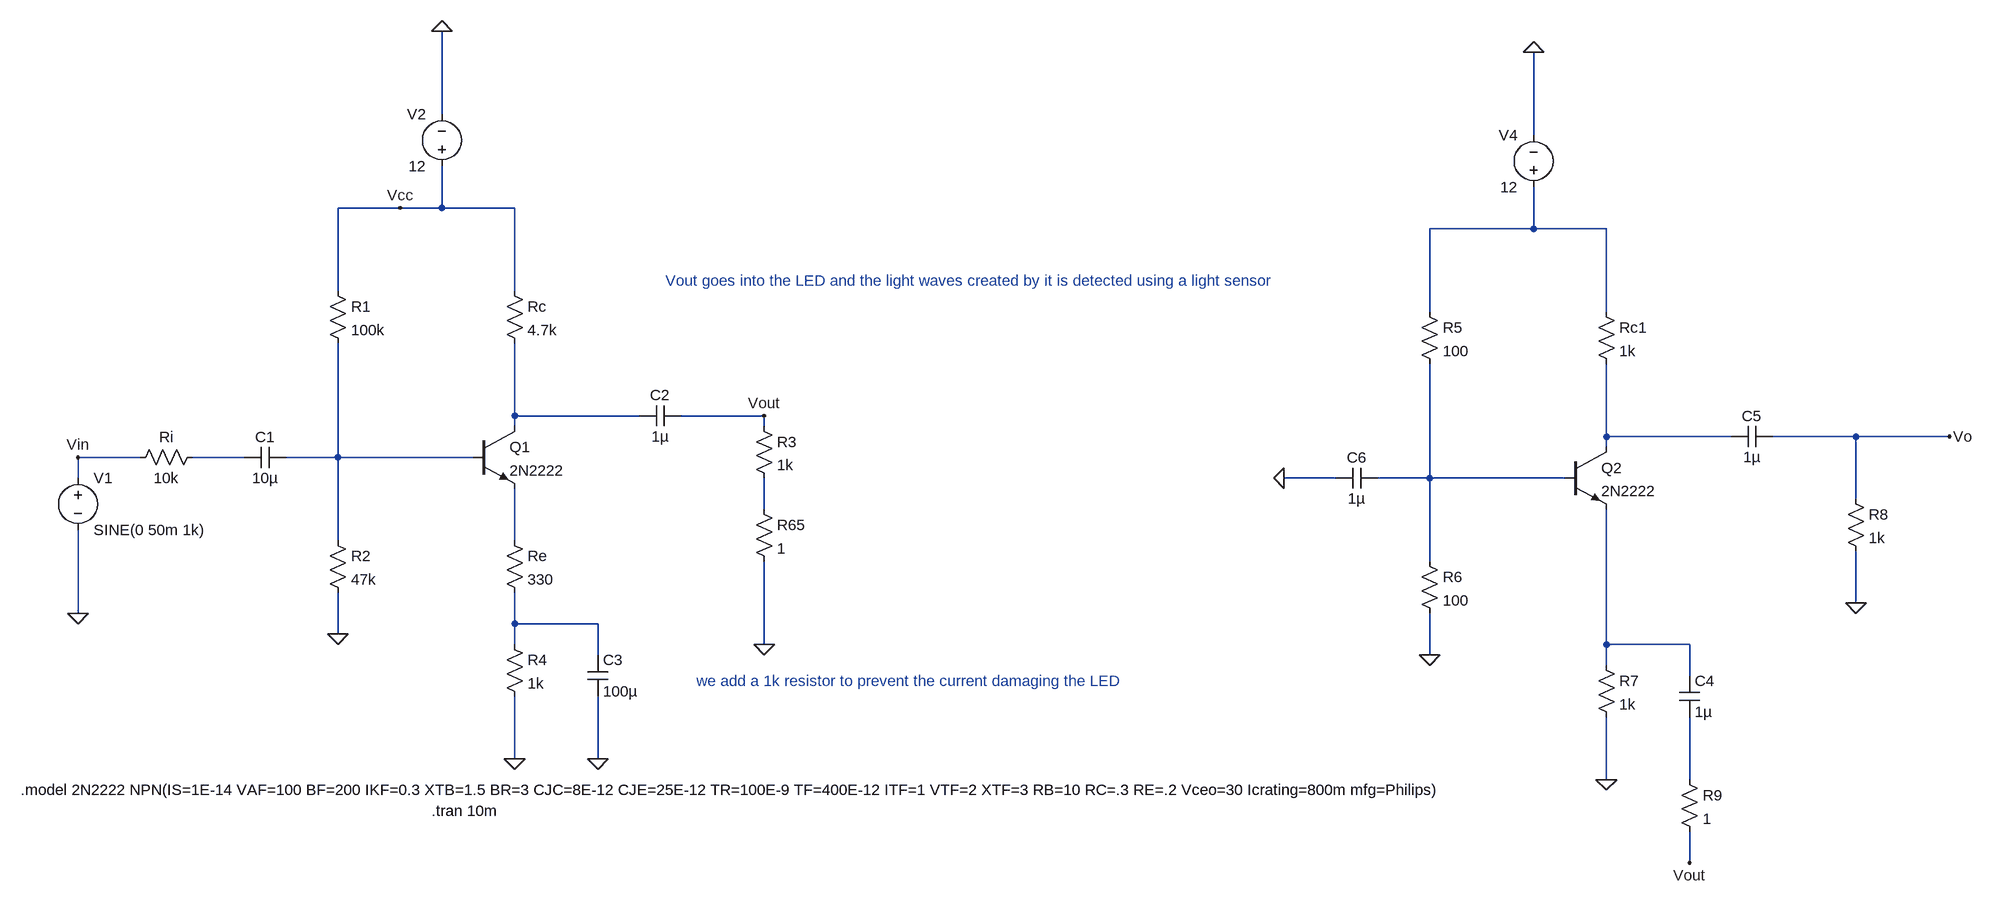
[diagram p0: schematic projects_deneme.asc]
projects_deneme.asc, the LTspice schematic file:
Version 4
SHEET 1 3096 1028
WIRE 304 -224 304 -352
WIRE 1984 -192 1984 -320
WIRE 240 -80 144 -80
WIRE 304 -80 304 -144
WIRE 304 -80 240 -80
WIRE 416 -80 304 -80
WIRE 1984 -48 1984 -112
WIRE 1984 -48 1824 -48
WIRE 2096 -48 1984 -48
WIRE 144 48 144 -80
WIRE 416 48 416 -80
WIRE 1824 80 1824 -48
WIRE 2096 80 2096 -48
WIRE 416 240 416 128
WIRE 608 240 416 240
WIRE 800 240 672 240
WIRE 416 256 416 240
WIRE 800 256 800 240
WIRE 2096 272 2096 160
WIRE 2288 272 2096 272
WIRE 2480 272 2352 272
WIRE 2624 272 2480 272
WIRE 2096 288 2096 272
WIRE -160 304 -256 304
WIRE 0 304 -80 304
WIRE 144 304 144 128
WIRE 144 304 64 304
WIRE 352 304 144 304
WIRE -256 336 -256 304
WIRE 1680 336 1600 336
WIRE 1824 336 1824 160
WIRE 1824 336 1744 336
WIRE 2032 336 1824 336
WIRE 2480 368 2480 272
WIRE 800 384 800 336
WIRE 144 432 144 304
WIRE 416 432 416 352
WIRE 1824 464 1824 336
WIRE 2480 528 2480 448
WIRE -256 544 -256 416
WIRE 416 560 416 512
WIRE 544 560 416 560
WIRE 144 576 144 512
WIRE 416 592 416 560
WIRE 800 592 800 464
WIRE 2096 592 2096 384
WIRE 2224 592 2096 592
WIRE 544 608 544 560
WIRE 1824 608 1824 544
WIRE 2096 624 2096 592
WIRE 2224 640 2224 592
WIRE 416 768 416 672
WIRE 544 768 544 672
WIRE 2096 800 2096 704
WIRE 2224 800 2224 704
WIRE 2224 928 2224 880
FLAG 304 -352 0
FLAG -256 544 0
FLAG 144 576 0
FLAG 416 768 0
FLAG 544 768 0
FLAG 800 592 0
FLAG -256 304 Vin
FLAG 240 -80 Vcc
FLAG 1984 -320 0
FLAG 1824 608 0
FLAG 2096 800 0
FLAG 2624 272 Vo
FLAG 1600 336 0
FLAG 2224 928 Vout
FLAG 2480 528 0
FLAG 800 240 Vout
SYMBOL res 128 32 R0
SYMATTR InstName R1
SYMATTR Value 100k
SYMBOL res 400 32 R0
SYMATTR InstName Rc
SYMATTR Value 4.7k
SYMBOL res 128 416 R0
SYMATTR InstName R2
SYMATTR Value 47k
SYMBOL res 400 416 R0
SYMATTR InstName Re
SYMATTR Value 330
SYMBOL res 400 576 R0
SYMATTR InstName R4
SYMATTR Value 1k
SYMBOL res 784 368 R0
SYMATTR InstName R65
SYMATTR Value 1
SYMBOL cap 528 608 R0
SYMATTR InstName C3
SYMATTR Value 100µ
SYMBOL cap 672 224 R90
WINDOW 0 0 32 VBottom 2
WINDOW 3 32 32 VTop 2
SYMATTR InstName C2
SYMATTR Value 1µ
SYMBOL res -64 288 R90
WINDOW 0 0 56 VBottom 2
WINDOW 3 32 56 VTop 2
SYMATTR InstName Ri
SYMATTR Value 10k
SYMBOL cap 64 288 R90
WINDOW 0 0 32 VBottom 2
WINDOW 3 32 32 VTop 2
SYMATTR InstName C1
SYMATTR Value 10µ
SYMBOL voltage -256 320 R0
WINDOW 123 0 0 Left 0
WINDOW 39 0 0 Left 0
SYMATTR InstName V1
SYMATTR Value SINE(0 50m 1k)
SYMBOL voltage 304 -128 R180
WINDOW 0 24 96 Left 2
WINDOW 3 24 16 Left 2
WINDOW 123 0 0 Left 0
WINDOW 39 0 0 Left 0
SYMATTR InstName V2
SYMATTR Value 12
SYMBOL npn 352 256 R0
SYMATTR InstName Q1
SYMATTR Value 2N2222
SYMBOL res 784 240 R0
SYMATTR InstName R3
SYMATTR Value 1k
SYMBOL res 1808 64 R0
SYMATTR InstName R5
SYMATTR Value 100
SYMBOL res 2080 64 R0
SYMATTR InstName Rc1
SYMATTR Value 1k
SYMBOL res 1808 448 R0
SYMATTR InstName R6
SYMATTR Value 100
SYMBOL res 2080 608 R0
SYMATTR InstName R7
SYMATTR Value 1k
SYMBOL cap 2208 640 R0
SYMATTR InstName C4
SYMATTR Value 1µ
SYMBOL cap 2352 256 R90
WINDOW 0 0 32 VBottom 2
WINDOW 3 32 32 VTop 2
SYMATTR InstName C5
SYMATTR Value 1µ
SYMBOL cap 1744 320 R90
WINDOW 0 0 32 VBottom 2
WINDOW 3 32 32 VTop 2
SYMATTR InstName C6
SYMATTR Value 1µ
SYMBOL voltage 1984 -96 R180
WINDOW 0 24 96 Left 2
WINDOW 3 24 16 Left 2
WINDOW 123 0 0 Left 0
WINDOW 39 0 0 Left 0
SYMATTR InstName V4
SYMATTR Value 12
SYMBOL npn 2032 288 R0
SYMATTR InstName Q2
SYMATTR Value 2N2222
SYMBOL res 2208 784 R0
SYMATTR InstName R9
SYMATTR Value 1
SYMBOL res 2464 352 R0
SYMATTR InstName R8
SYMATTR Value 1k
TEXT -344 816 Left 2 !.model 2N2222 NPN(IS=1E-14 VAF=100 BF=200 IKF=0.3 XTB=1.5 BR=3 CJC=8E-12 CJE=25E-12 TR=100E-9 TF=400E-12 ITF=1 VTF=2 XTF=3 RB=10 RC=.3 RE=.2 Vceo=30 Icrating=800m mfg=Philips)
TEXT 288 848 Left 2 !.tran 10m
TEXT 696 648 Left 2 ;we add a 1k resistor to prevent the current damaging the LED
TEXT 648 32 Left 2 ;Vout goes into the LED and the light waves created by it is detected using a light sensor

The netlist it stands for:
* projects_deneme.asc
R1 Vcc N005 100k
Rc Vcc N002 4.7k
R2 N005 0 47k
Re N008 N009 330
R4 N009 0 1k
R65 N007 0 1
C3 N009 0 100µ
C2 Vout N002 1µ
Ri N004 Vin 10k
C1 N005 N004 10µ
V1 Vin 0 SINE(0 50m 1k)
V2 Vcc 0 12
Q1 N002 N005 N008 0 2N2222
R3 Vout N007 1k
R5 N001 N006 100
Rc1 N001 N003 1k
R6 N006 0 100
R7 N010 0 1k
C4 N010 N011 1µ
C5 Vo N003 1µ
C6 N006 0 1µ
V4 N001 0 12
Q2 N003 N006 N010 0 2N2222
R9 N011 Vout 1
R8 Vo 0 1k
.model NPN NPN
.model PNP PNP
.lib standard.bjt
.model 2N2222 NPN(IS=1E-14 VAF=100 BF=200 IKF=0.3 XTB=1.5 BR=3 CJC=8E-12 CJE=25E-12 TR=100E-9 TF=400E-12 ITF=1 VTF=2 XTF=3 RB=10 RC=.3 RE=.2 Vceo=30 Icrating=800m mfg=Philips)
.tran 10m
* we add a 1k resistor to prevent the current damaging the LED
* Vout goes into the LED and the light waves created by it is detected using a light sensor
.backanno
.end